# EAGLE design 555 (EAGLE 7.2.0)
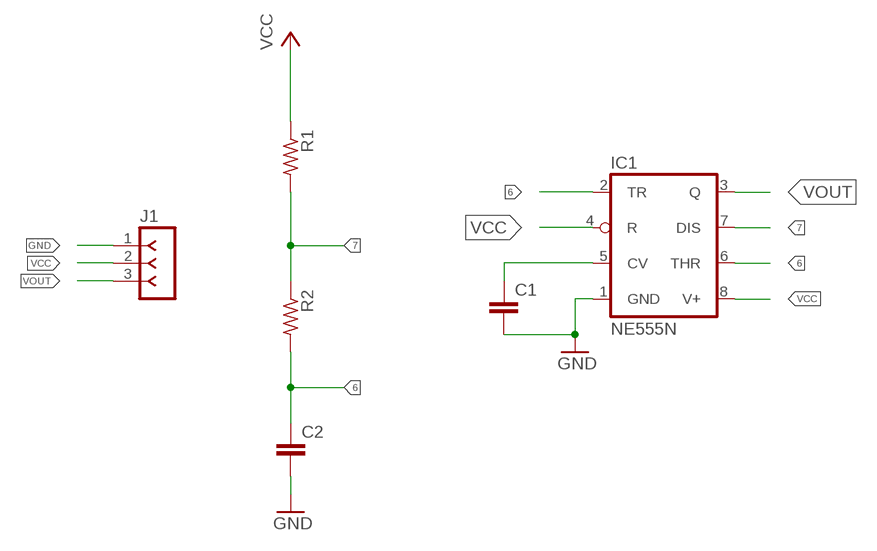
[diagram p0: schematic, sheet 1]

## Parts
C1  C2.5/2  [C2.5-2]
C2  C2.5/2  [C2.5-2]
IC1  NE555N  [DIL08-ROUND]
J1  F-1X03-SIP-100-40  [SIP-100-03-40]
R1  R-US_0204/7  [0204/7]
R2  R-US_0204/7  [0204/7]

## Nets
6: C2.1 IC1.2(TR) IC1.6(THR) R2.2
7: IC1.7(DIS) R1.2 R2.1
GND: C1.2 C2.2 IC1.1(GND) J1.1
N$5: C1.1 IC1.5(CV)
VCC: IC1.4(R) IC1.8(V+) J1.2 R1.1
VOUT: IC1.3(Q) J1.3

## Library data of the parts
C1 C2 = capacitor-wima:C: CAPACITOR naming: grid - package width
IC1 = adafruit:*555: TIMER Changed DIP package to have round (not oval) pin pads http://www.ladyada.net/library/pcb/eaglelibrary.html
J1 = con-headers-jp:F-1X03-: FEMALE HEADER
R1 R2 = adafruit:R-US_: RESISTOR, American symbol

## Board
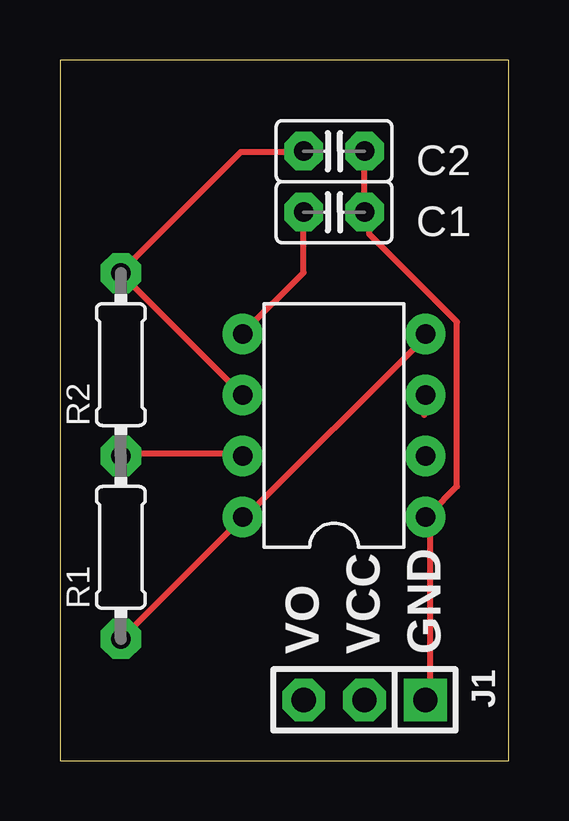
[diagram p1: board, top side]
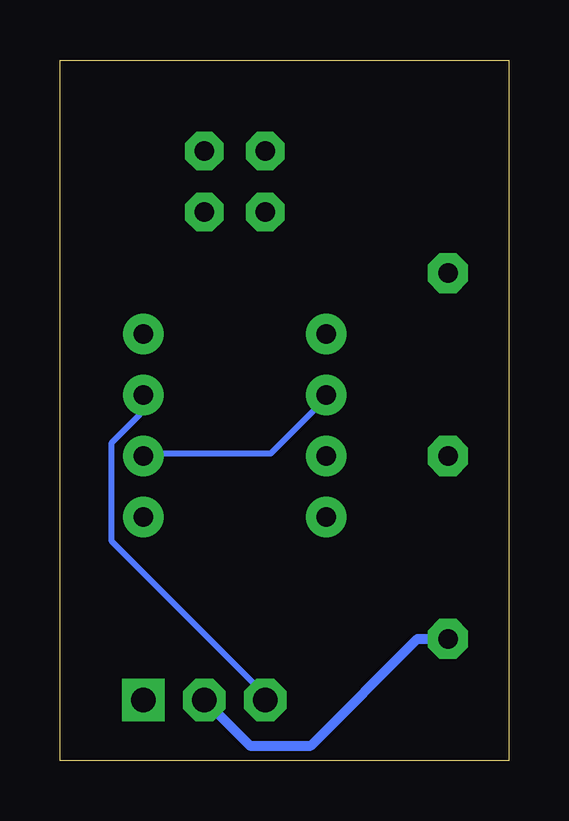
[diagram p2: board, bottom side, seen from below]

Size 18.72 x 29.2 mm. Coordinates in mm from the lower left corner, seen from the top.
Outline: 0,0 18.72,0 18.72,29.2 0,29.2 0,0
Copper layers (1*16): Top 0.035mm / dielectric 1.5mm / Bottom 0.035mm
Design rules "default": minimum track width 10mil, minimum drill 24mil, track to track 8mil, track to pad 8mil, pad to pad 8mil, via to via 8mil, smd to smd 8mil, copper to edge 40mil, drill to drill 8mil, minimum pad ring 10mil, minimum via ring 8mil, stop-mask expansion 4mil, vias tented up to drill 0mil, thermal gap 10mil

### Footprints (pad centres in the part's own frame; a part is rotated, then mirrored left to right if it is on the bottom)
C2.5-2 = drill 0.813 pad 1.6 octagon: 1 -1.27,0; 2 1.27,0
DIL08-ROUND = drill 0.813 pad 1.676: 1 -3.81,-3.81; 2 -1.27,-3.81; 3 1.27,-3.81; 4 3.81,-3.81; 5 3.81,3.81; 6 1.27,3.81; 7 -1.27,3.81; 8 -3.81,3.81
SIP-100-03-40 = drill 1.016 pad 1.778 square: 1 -2.54,0 | drill 1.016 pad 1.778 octagon: 2 0,0; 3 2.54,0
0204/7 = drill 0.813 pad 1.676 octagon: 1 -3.81,0; 2 3.81,0

### Placement (x,y rotation side)
C1  11.43,22.86 0 top
C2  11.43,25.4 0 top
IC1  11.43,13.97 90 top
J1  12.7,2.54 180 top
R1  2.54,8.89 90 top
R2  2.54,16.51 90 top

### Tracks (layer width: path | path; a pad name or v marks a point on that pad's centre or on a via)
6
  Top 0.254: C2.1 10.16,25.38 7.54,25.38 2.52,20.34 R2.2 IC1.6
  Bottom 0.254: IC1.2 15.19,12.8 9.93,12.8 7.64,15.09 IC1.6
7
  Top 0.254: 2.52,12.8 R2.1 2.74,12.8 7.54,12.8 IC1.7
GND
  Top 0.254: C2.2 12.68,25.38 12.68,22.86 C1.2 12.9,22.86 12.9,21.95 16.56,18.29 16.56,11.43 15.42,10.29 IC1.1 15.42,10.06 15.42,2.74 J1.1
N$5
  Top 0.254: C1.1 10.16,20.34 7.64,17.83 IC1.5
VCC
  Top 0.254: IC1.4 15.19,17.6 7.64,10.06 IC1.8 7.54,10.06 2.74,5.26 R1.1
  Bottom 0.406: J1.2 10.79,0.64 8.26,0.64 3.81,5.08 R1.1
VOUT
  Top 0.254: 15.19,14.4 15.19,15.09 IC1.3
  Bottom 0.254: IC1.3 15.42,15.09 15.42,14.4 16.56,13.26 16.56,9.14 10.16,2.74 J1.3

### Text on the board
tNames: VO | VCC | GND